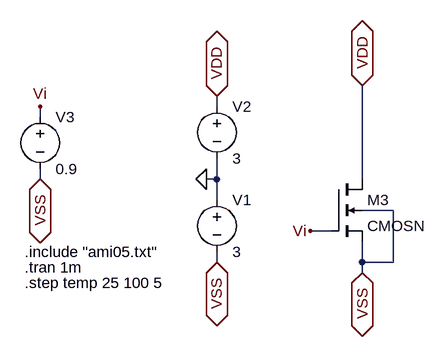
[diagram p0: schematic efectosTemperatura.asc]
efectosTemperatura.asc, the LTspice schematic file:
Version 4
SHEET 1 1444 784
WIRE -64 160 -64 144
WIRE -336 176 -336 160
WIRE -336 272 -336 256
WIRE -64 272 -64 240
WIRE -64 272 -80 272
WIRE 160 272 160 128
WIRE -64 304 -64 272
WIRE 208 320 160 320
WIRE 112 352 80 352
WIRE -64 400 -64 384
WIRE 160 400 160 368
WIRE 208 400 208 320
WIRE 208 400 160 400
WIRE 160 416 160 400
FLAG -80 272 0
FLAG -64 400 VSS
IOPIN -64 400 BiDir
FLAG -64 144 VDD
IOPIN -64 144 BiDir
FLAG -336 160 Vi
FLAG 160 128 VDD
IOPIN 160 128 BiDir
FLAG 160 416 VSS
IOPIN 160 416 BiDir
FLAG 80 352 Vi
FLAG -336 272 VSS
IOPIN -336 272 BiDir
SYMBOL voltage -64 288 R0
SYMATTR InstName V1
SYMATTR Value 3
SYMBOL voltage -64 144 R0
SYMATTR InstName V2
SYMATTR Value 3
SYMBOL nmos4 112 272 R0
SYMATTR InstName M3
SYMATTR Value CMOSN
SYMATTR Value2 l=1.2u w=300u
SYMBOL voltage -336 160 R0
WINDOW 123 0 0 Left 0
WINDOW 39 0 0 Left 0
SYMATTR InstName V3
SYMATTR Value 0.9
TEXT -360 384 Left 2 !.include "ami05.txt"
TEXT -360 408 Left 2 !.tran 1m
TEXT -360 432 Left 2 !.step temp 25 100 5

The netlist it stands for:
* efectosTemperatura.asc
V1 0 VSS 3
V2 VDD 0 3
M3 VDD Vi VSS VSS CMOSN l=1.2u w=300u
V3 Vi VSS 0.9
.model NMOS NMOS
.model PMOS PMOS
.lib standard.mos
.include "ami05.txt"
.tran 1m
.step temp 25 100 5
.backanno
.end